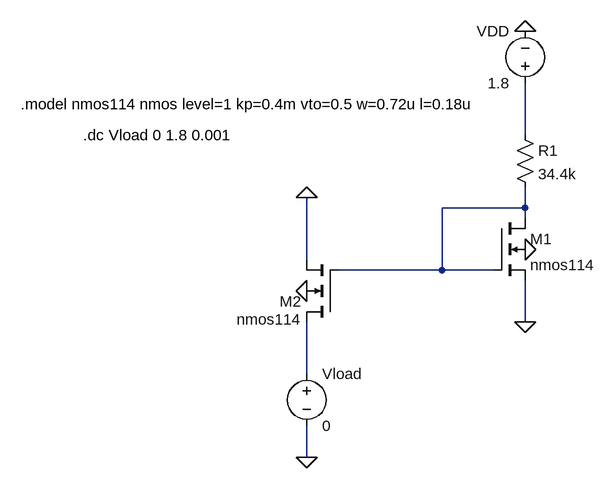
[diagram p0: schematic EENG304L Lab7.asc]
EENG304L Lab7.asc, the LTspice schematic file:
Version 4.1
SHEET 1 880 680
WIRE 576 16 576 -64
WIRE 576 128 576 96
WIRE 576 128 448 128
WIRE 576 144 576 128
WIRE 240 208 240 112
WIRE 448 224 448 128
WIRE 448 224 288 224
WIRE 528 224 448 224
WIRE 576 304 576 240
WIRE 240 384 240 304
WIRE 240 512 240 464
FLAG 240 112 0
FLAG 576 -144 0
FLAG 576 304 0
FLAG 240 512 0
FLAG 240 256 0
FLAG 576 192 0
SYMBOL res 560 0 R0
SYMATTR InstName R1
SYMATTR Value 34.4k
SYMBOL voltage 576 -48 R180
WINDOW 0 24 96 Left 2
WINDOW 3 24 16 Left 2
SYMATTR InstName VDD
SYMATTR Value 1.8
SYMBOL nmos4 528 144 R0
SYMATTR InstName M1
SYMATTR Value nmos114
SYMATTR Value2 l=0.18u w=0.72u
SYMBOL nmos4 288 304 R180
WINDOW 3 56 4 Left 2
SYMATTR InstName M2
SYMATTR Value nmos114
SYMATTR Value2 l=0.18u w=0.72u
SYMBOL voltage 240 368 R0
SYMATTR InstName Vload
SYMATTR Value 0
TEXT -104 16 Left 2 !.dc Vload 0 1.8 0.001
TEXT -200 -32 Left 2 !.model nmos114 nmos level=1 kp=0.4m vto=0.5 w=0.72u l=0.18u

The netlist it stands for:
* EENG304L Lab7.asc
R1 N001 N002 34.4k
VDD N001 0 1.8
M1 N002 N002 0 0 nmos114 l=0.18u w=0.72u
M2 N003 N002 0 0 nmos114 l=0.18u w=0.72u
Vload N003 0 0
.model NMOS NMOS
.model PMOS PMOS
.lib standard.mos
.dc Vload 0 1.8 0.001
.model nmos114 nmos level=1 kp=0.4m vto=0.5 w=0.72u l=0.18u
.backanno
.end